# EasyEDA Pro project 进阶学习.eprj

# Schematic Schematic1

## Sheets
1 38译码电路: Board Name: Board1; Create Date: 2024-10-17; Page Name: 38译码电路; Project Name: 进阶学习; Schematic Name: Schematic1; Update Date: 2024-10-17; Company: 嘉立创EDA; Page Size: A4; Version: V1.0
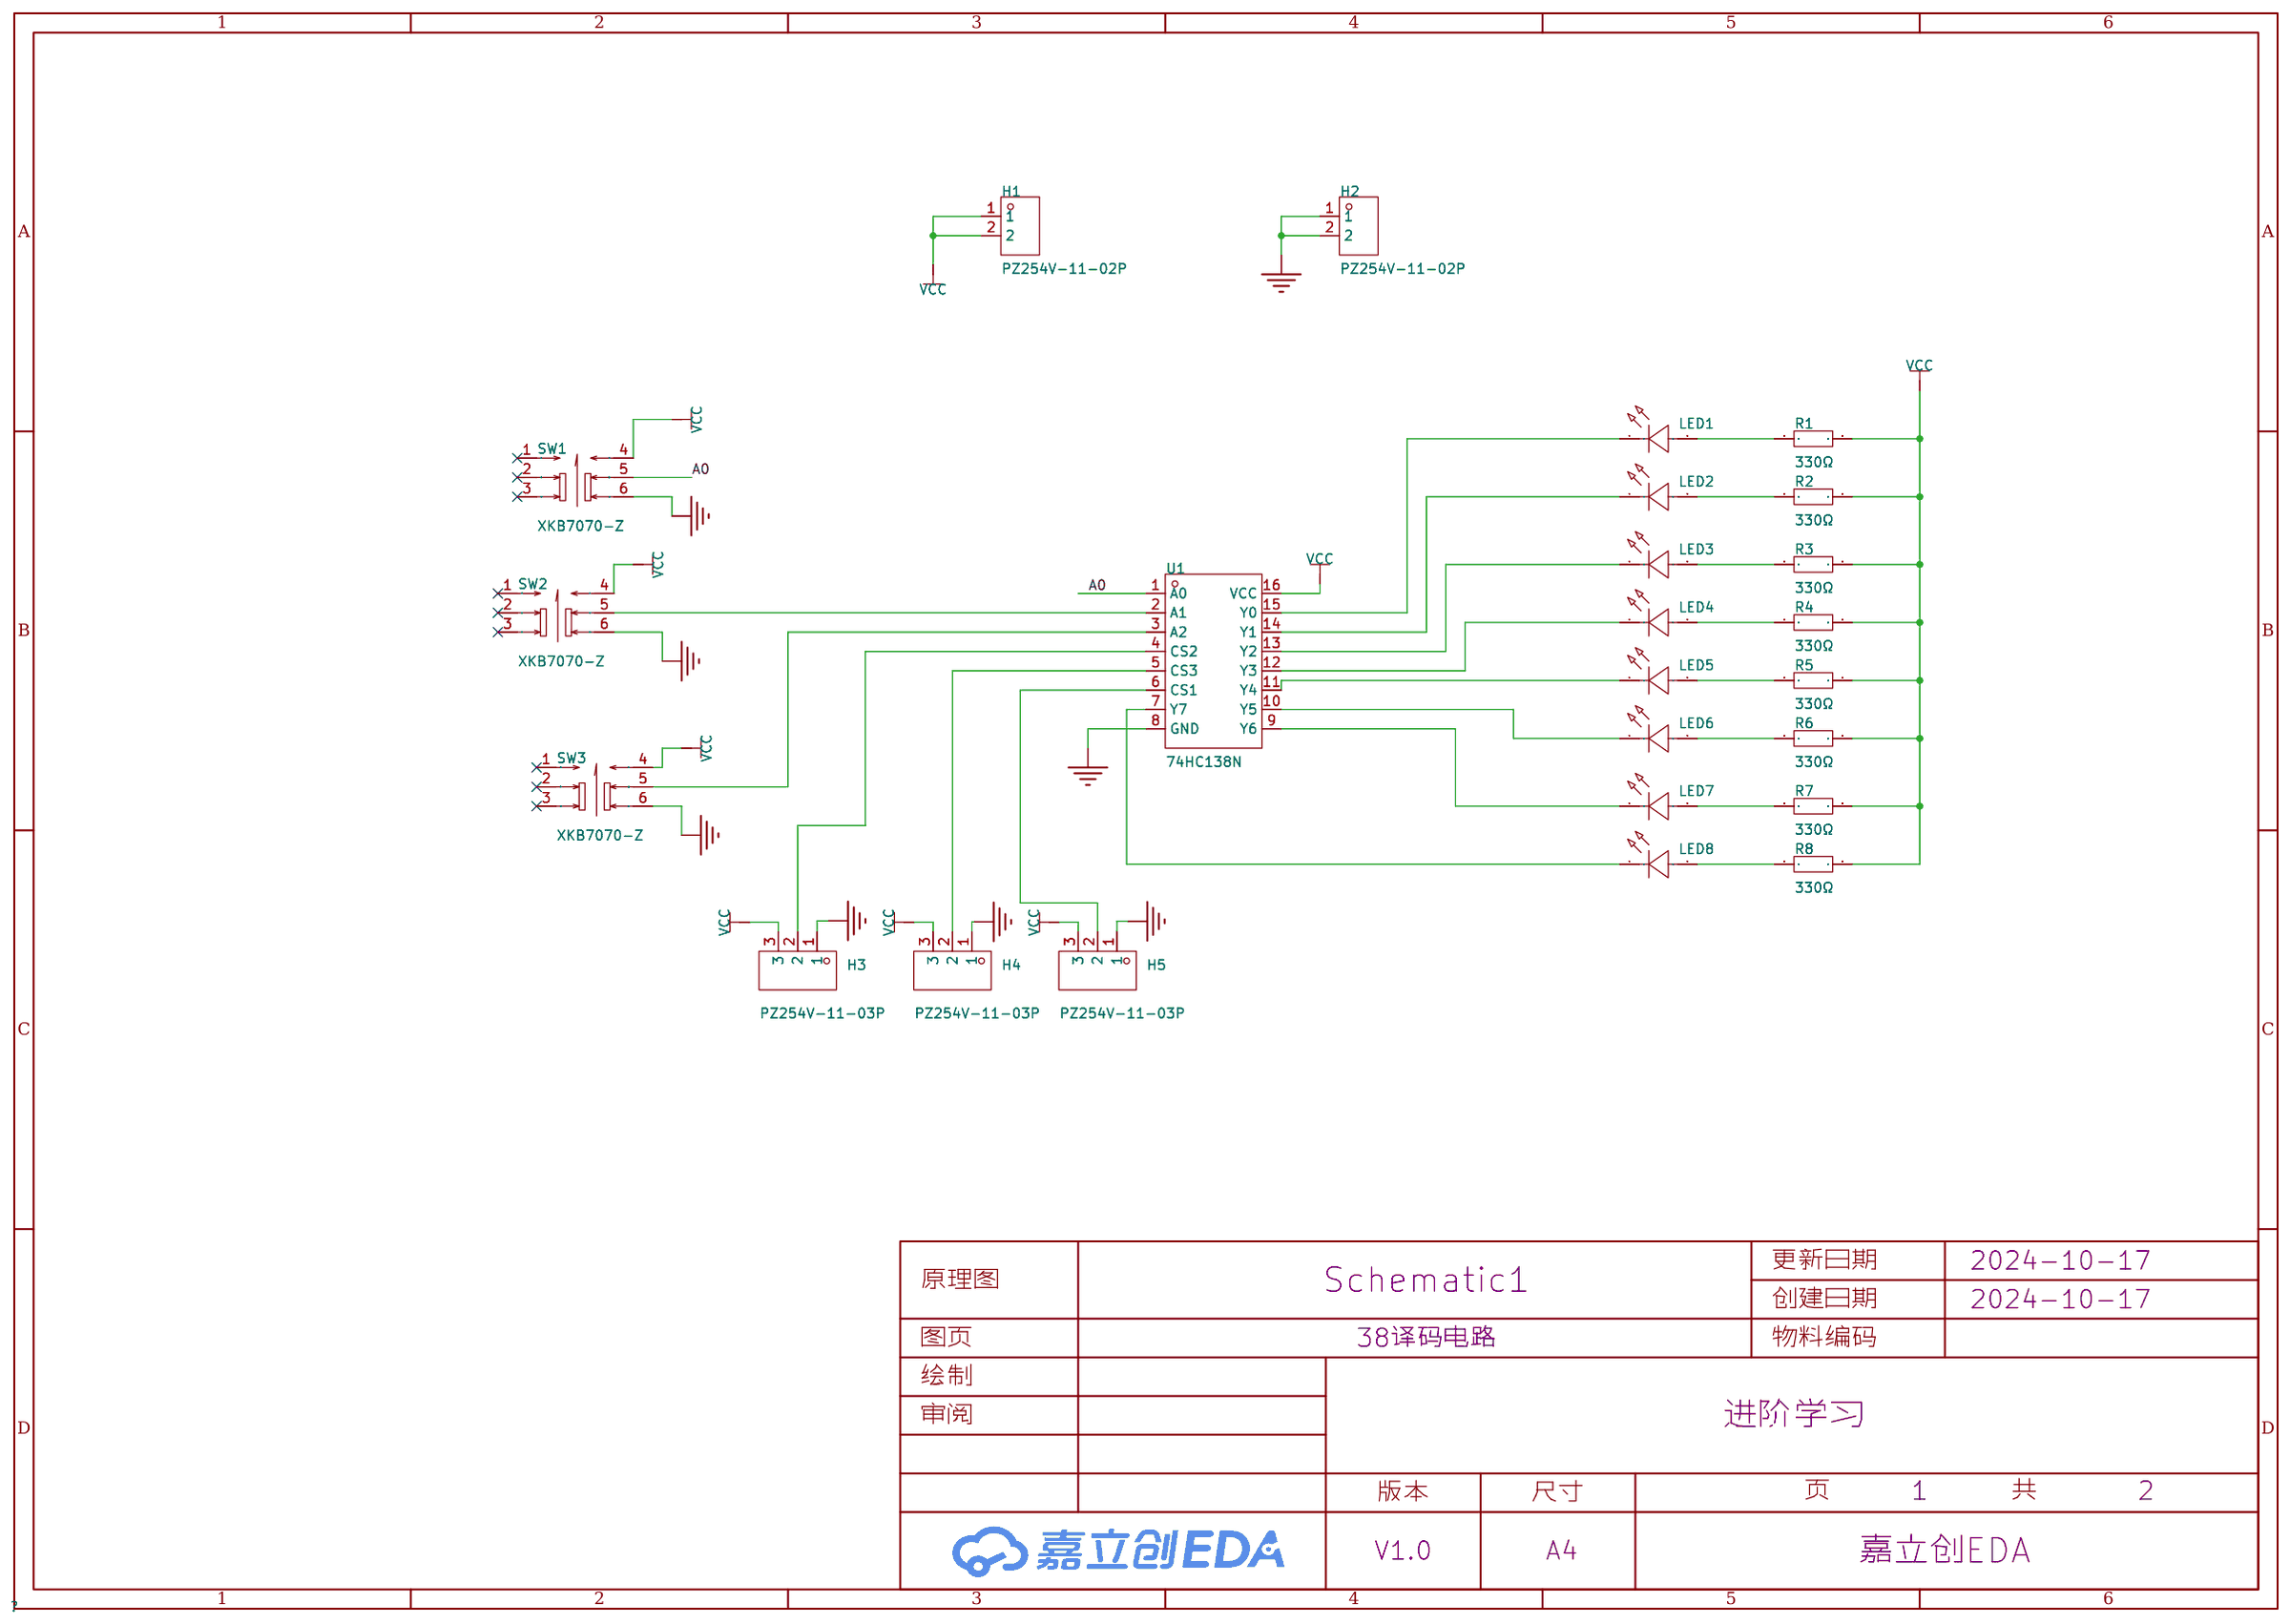
[diagram p0: 38译码电路]
2 245信号放大电路: Page Name: 245信号放大电路
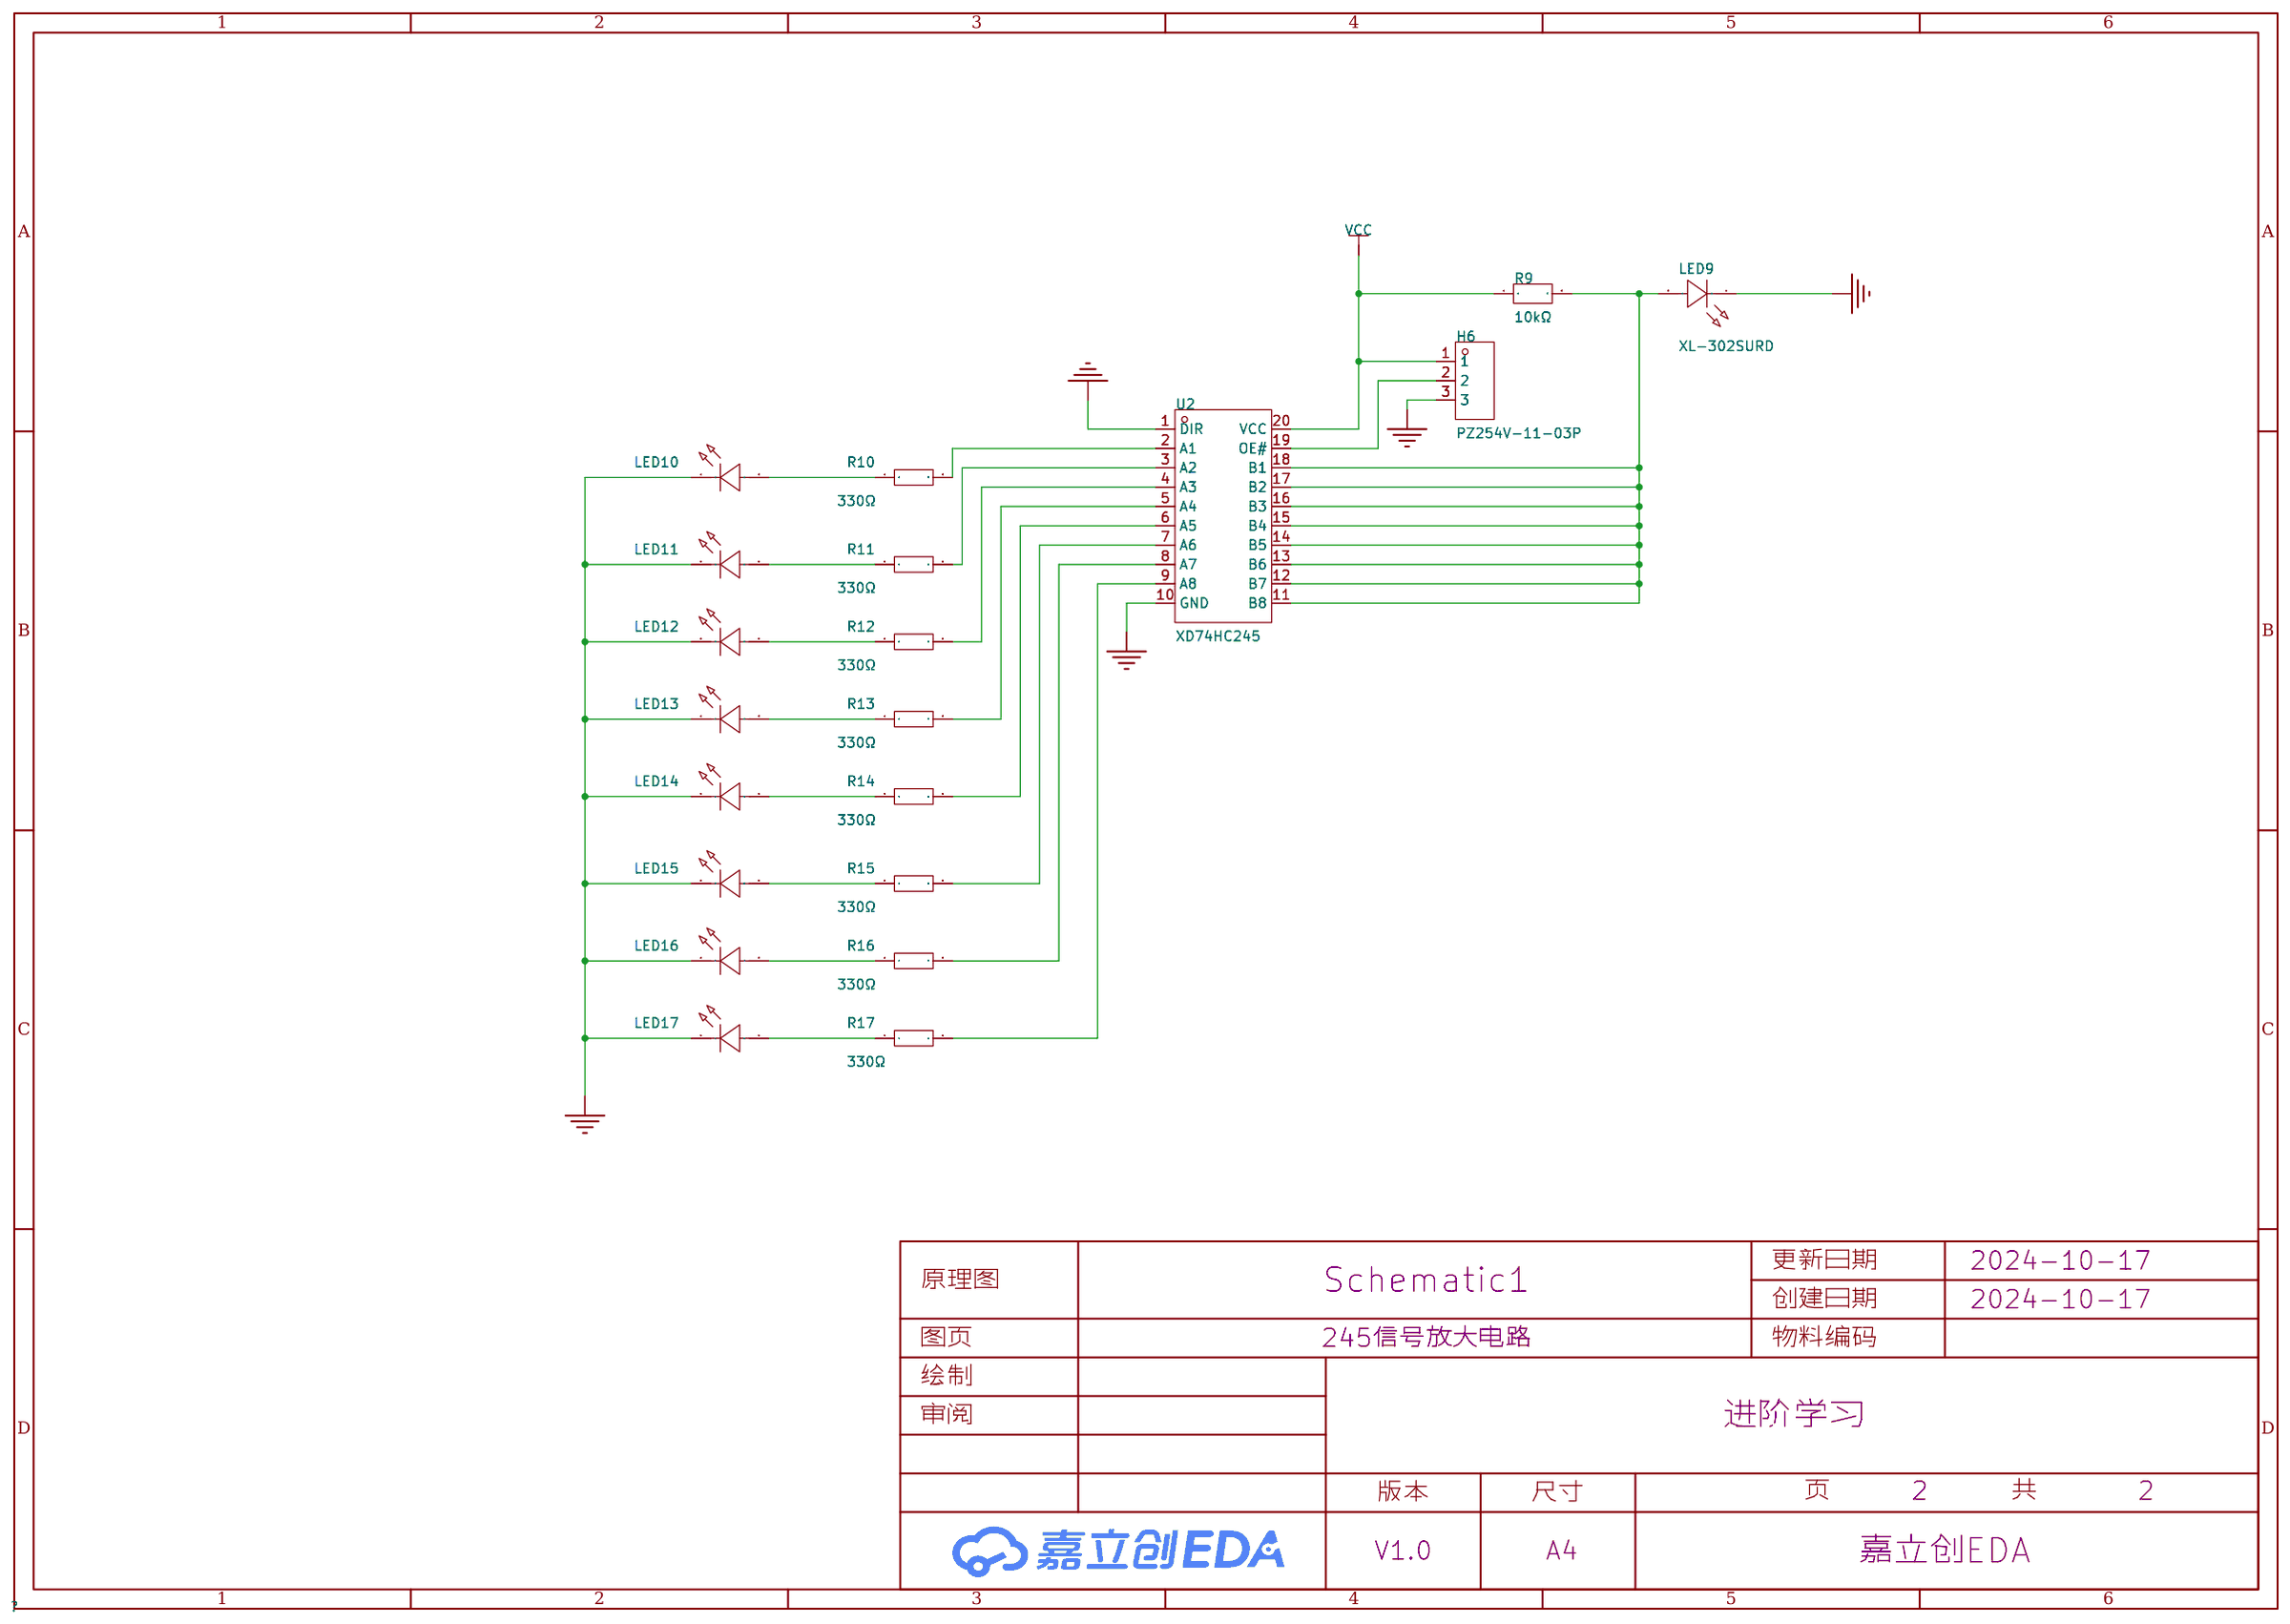
[diagram p1: 245信号放大电路]
3 USB供电: Page Name: USB供电
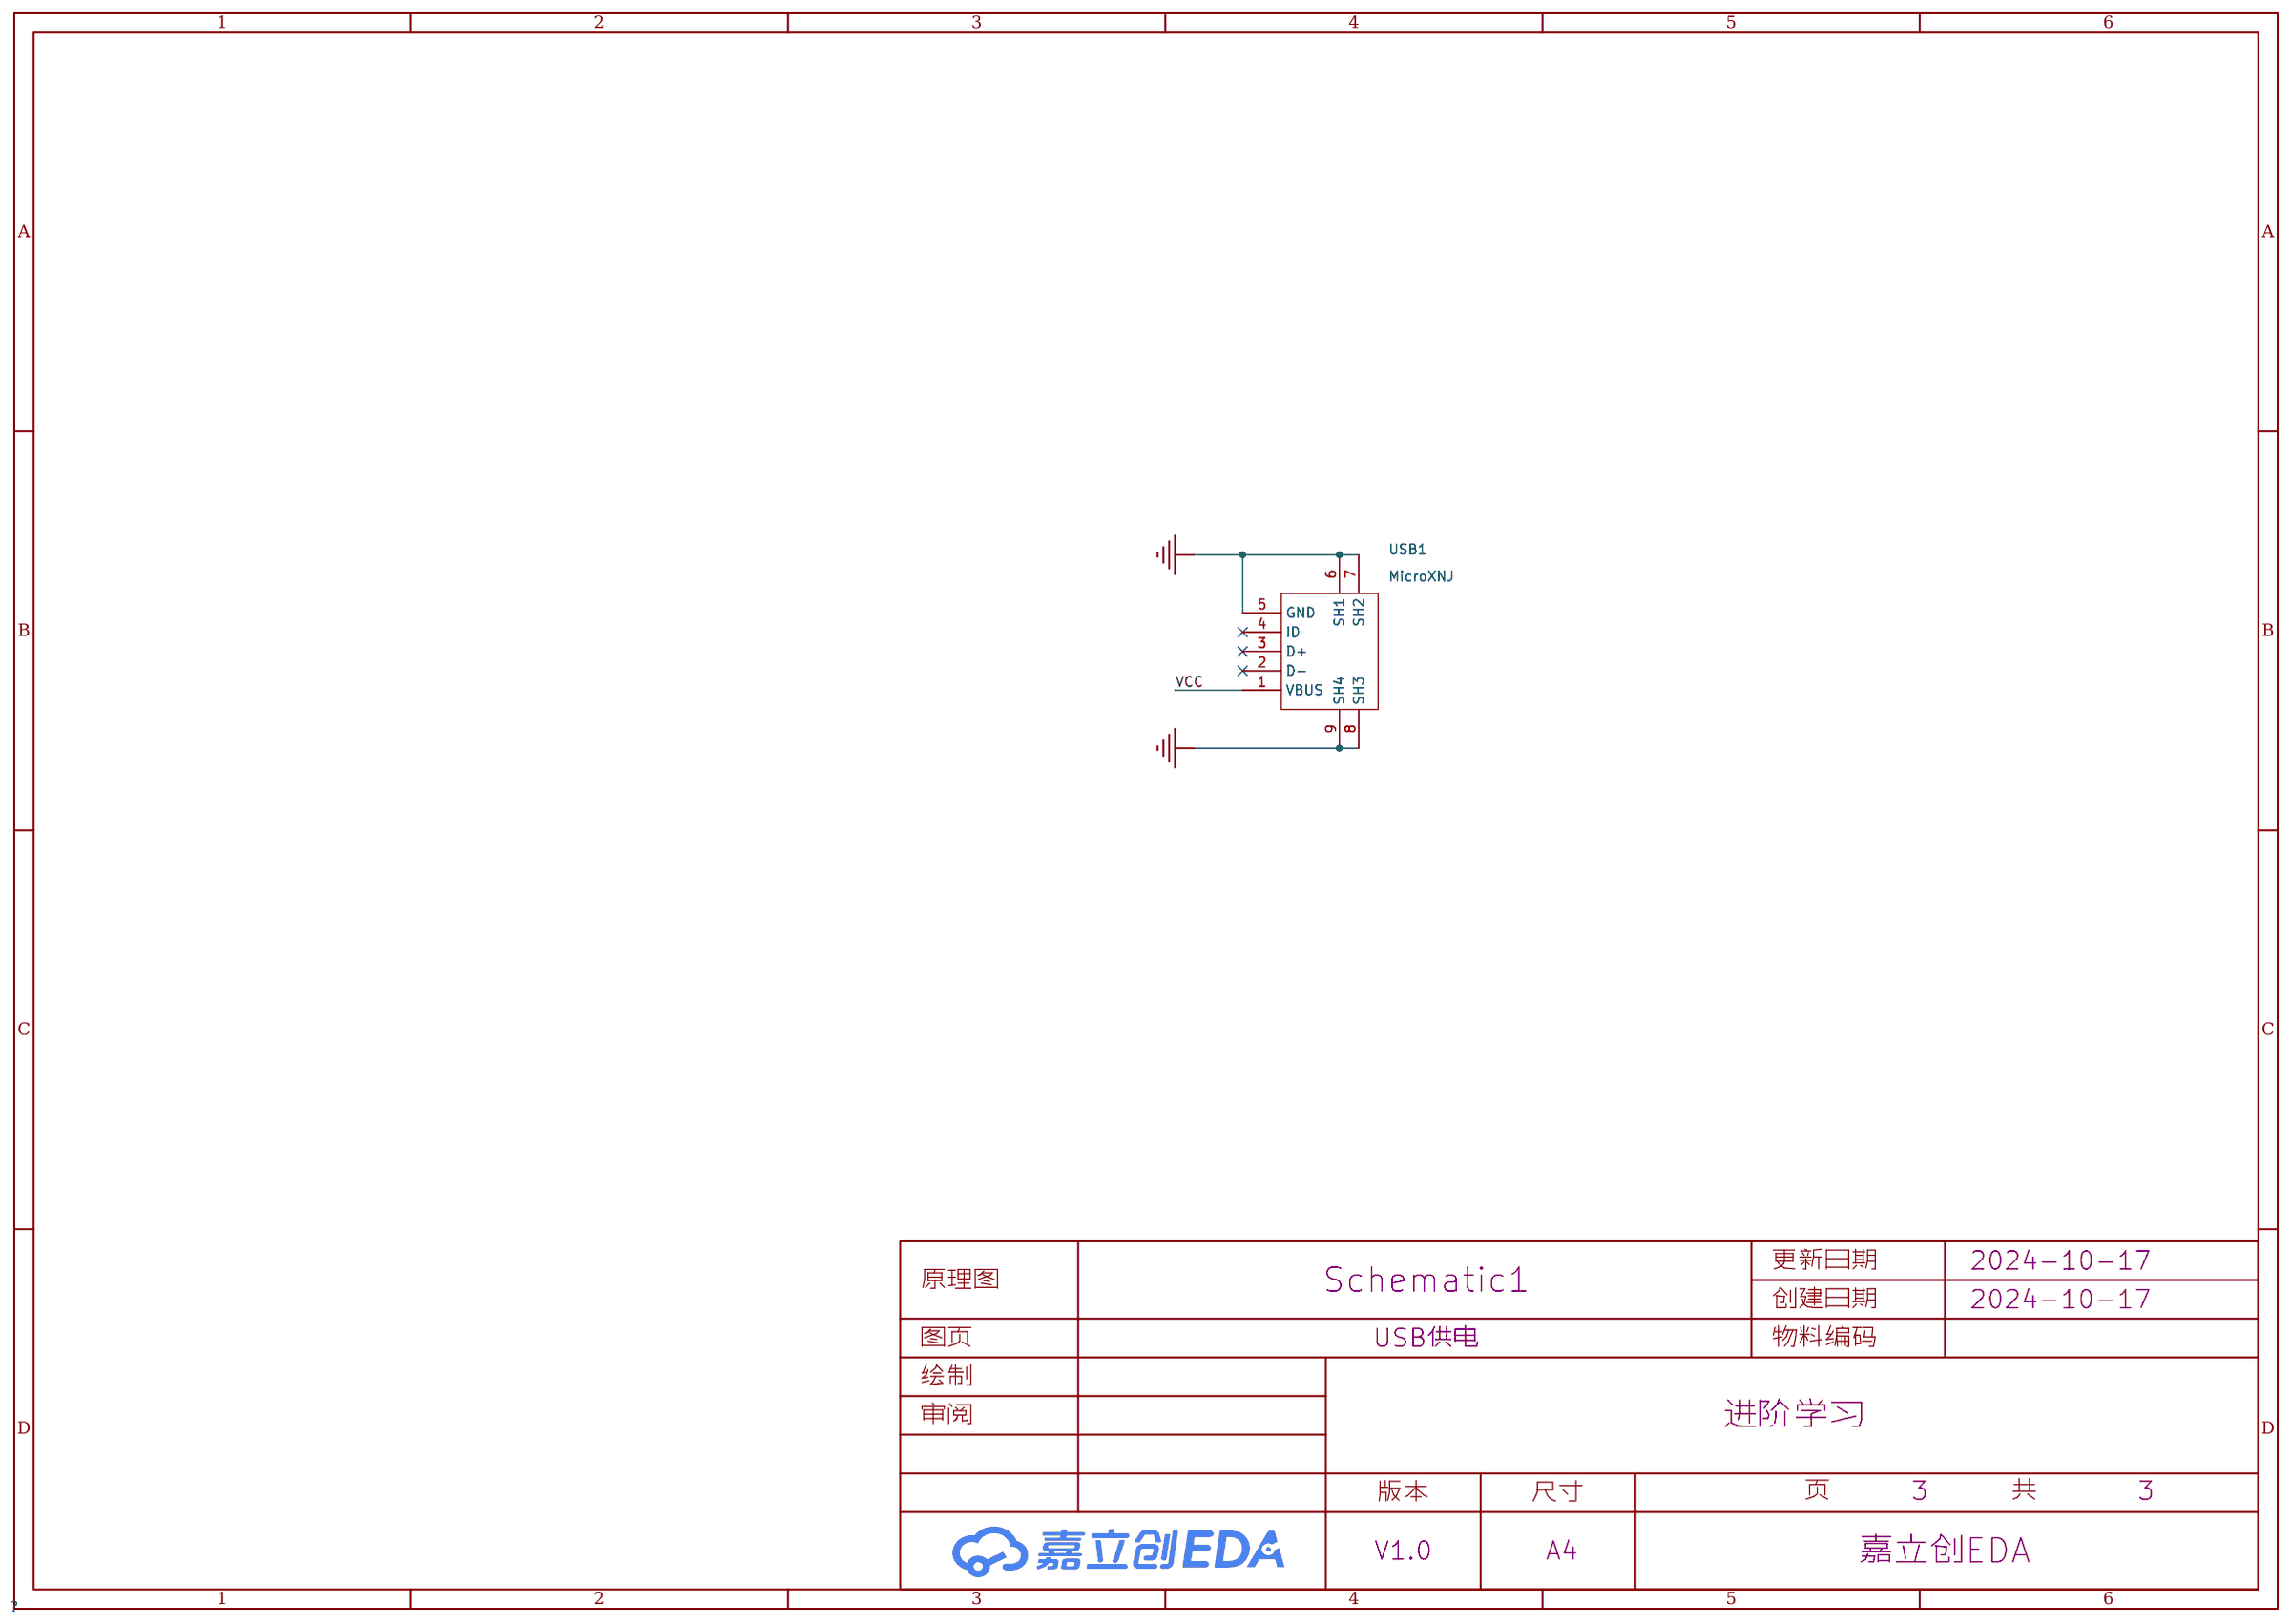
[diagram p2: USB供电]

## Parts
sheet 38译码电路
H1  PZ254V-11-02P  [HDR-TH_2P-P2.54-V-M]
H2  PZ254V-11-02P  [HDR-TH_2P-P2.54-V-M]
H3  PZ254V-11-03P  [HDR-TH_3P-P2.54-V-M]
H4  PZ254V-11-03P  [HDR-TH_3P-P2.54-V-M]
H5  PZ254V-11-03P  [HDR-TH_3P-P2.54-V-M]
LED1  XL-302SURD  [LED-TH_BD3.8-P2.54-RD]
LED2  XL-302SURD  [LED-TH_BD3.8-P2.54-RD]
LED3  XL-302SURD  [LED-TH_BD3.8-P2.54-RD]
LED4  XL-302SURD  [LED-TH_BD3.8-P2.54-RD]
LED5  XL-302SURD  [LED-TH_BD3.8-P2.54-RD]
LED6  XL-302SURD  [LED-TH_BD3.8-P2.54-RD]
LED7  XL-302SURD  [LED-TH_BD3.8-P2.54-RD]
LED8  XL-302SURD  [LED-TH_BD3.8-P2.54-RD]
R1  330Ω  [RES-TH_BD2.3-L3.7-P7.70-D0.9]
R2  330Ω  [RES-TH_BD2.3-L3.7-P7.70-D0.9]
R3  330Ω  [RES-TH_BD2.3-L3.7-P7.70-D0.9]
R4  330Ω  [RES-TH_BD2.3-L3.7-P7.70-D0.9]
R5  330Ω  [RES-TH_BD2.3-L3.7-P7.70-D0.9]
R6  330Ω  [RES-TH_BD2.3-L3.7-P7.70-D0.9]
R7  330Ω  [RES-TH_BD2.3-L3.7-P7.70-D0.9]
R8  330Ω  [RES-TH_BD2.3-L3.7-P7.70-D0.9]
SW1  XKB7070-Z  [SW-TH_6P-L7.0-W7.0-P2.00]
SW2  XKB7070-Z  [SW-TH_6P-L7.0-W7.0-P2.00]
SW3  XKB7070-Z  [SW-TH_6P-L7.0-W7.0-P2.00]
U1  74HC138N  [DIP-16_L19.2-W6.6-P2.54-LS7.6-BL]
sheet 245信号放大电路
H6  PZ254V-11-03P  [HDR-TH_3P-P2.54-V-M]
LED9  XL-302SURD  [LED-TH_BD3.8-P2.54-RD]
LED10  XL-302SURD  [LED-TH_BD3.8-P2.54-RD]
LED11  XL-302SURD  [LED-TH_BD3.8-P2.54-RD]
LED12  XL-302SURD  [LED-TH_BD3.8-P2.54-RD]
LED13  XL-302SURD  [LED-TH_BD3.8-P2.54-RD]
LED14  XL-302SURD  [LED-TH_BD3.8-P2.54-RD]
LED15  XL-302SURD  [LED-TH_BD3.8-P2.54-RD]
LED16  XL-302SURD  [LED-TH_BD3.8-P2.54-RD]
LED17  XL-302SURD  [LED-TH_BD3.8-P2.54-RD]
R9  10kΩ  [RES-TH_BD1.8-L3.2-P7.20-D0.4]
R10  330Ω  [RES-TH_BD2.3-L3.7-P7.70-D0.9]
R11  330Ω  [RES-TH_BD2.3-L3.7-P7.70-D0.9]
R12  330Ω  [RES-TH_BD2.3-L3.7-P7.70-D0.9]
R13  330Ω  [RES-TH_BD2.3-L3.7-P7.70-D0.9]
R14  330Ω  [RES-TH_BD2.3-L3.7-P7.70-D0.9]
R15  330Ω  [RES-TH_BD2.3-L3.7-P7.70-D0.9]
R16  330Ω  [RES-TH_BD2.3-L3.7-P7.70-D0.9]
R17  330Ω  [RES-TH_BD2.3-L3.7-P7.70-D0.9]
U2  XD74HC245  [DIP-20_L26.8-W6.4-P2.54-LS7.6-BL]
sheet USB供电
USB1  MicroXNJ  [MICRO-USB-SMD_MICROXNJ]

## Library data of the parts
H1 H2 = PZ254V-11-02P: LCSC Part Name: 间距:2.54mm 1x2P 直插 方针; Supplier Part: C492401; Manufacturer: XFCN(兴飞); Supplier Footprint: 插件,P=2.54mm; JLCPCB Part Class: Extended Part; Datasheet: https://atta.szlcsc.com/upload/public/pdf/source/20200309/C492401_A812433581A9B211A7FFA413ADDFF0E5.pdf; Supplier: LCSC; Pin Structure: 1x2P; Pitch: 2.54mm; Circluar Pins/Square Pins: 方针; Mounting Type: 直插; Number of Rows: 单排; Number of Pins: 2P; Length of Mating Pin: 6mm; Insulation Height: 2.5mm; Length of End Connection Pin: 3mm; Contact Material: 黄铜; Operating Temperature Range: -40℃~+105℃; Color: 黑色
H3-H6 = PZ254V-11-03P: LCSC Part Name: 间距:2.54mm 1x3P 直插 方针; Supplier Part: C2937625; Manufacturer: XFCN(兴飞); Supplier Footprint: 插件,P=2.54mm; JLCPCB Part Class: Extended Part; Datasheet: https://atta.szlcsc.com/upload/public/pdf/source/20200309/C492402_8335C3D49C4E4C618838D59BB1D024C1.pdf; Supplier: LCSC; Pin Structure: 1x3P; Pitch: 2.54mm; Circluar Pins/Square Pins: 方针; Mounting Type: 直插; Number of Rows: 单排; Number of Pins: 3P; Current Rating (Max): 3A; Voltage Rating (Max): 250V; Length of Mating Pin: 6mm; Insulation Height: 2.5mm; Length of End Connection Pin: 3mm; Operating Temperature Range: -40℃~+105℃; Color: 黑色
LED1-LED17 = XL-302SURD: Supplier Part: C2895470; Manufacturer: XINGLIGHT(成兴光); Supplier Footprint: 插件,D=3mm; JLCPCB Part Class: Extended Part; Datasheet: https://atta.szlcsc.com/upload/public/pdf/source/20240112/E1E2B82945FD635E4907401DDE6D4922.pdf; Supplier: LCSC; Lamp Holder Type: 3mm圆形灯头; Emitted Color: 红色; Power Dissipation: 80mW; Forward Current: 30mA; Dominant Wavelength: 615nm~620nm; Peak Wavelength: 625nm; Lens Color: 红色透镜; Viewing Angle: 50°; Operating Temperature: -25℃~+85℃
R1-R8 R10-R17 = MF1/8W-330Ω±1%-OT52: LCSC Part Name: 金属膜电阻 330Ω ±1% 125mW; Supplier Part: C2848567; Manufacturer: VO(翔胜); Supplier Footprint: 插件,D2.3xL3.7mm; JLCPCB Part Class: Extended Part; Supplier: LCSC; Type: 金属膜电阻; Tolerance: ±1%; Overload Voltage (Max): 200V; Power(Watts): 125mW; Temperature Coefficient: ±350ppm/℃; Operating Temperature Range: -55℃~+155℃
SW1-SW3 = XKB7070-Z: LCSC Part Name: 按键开关   7*7插件自锁 蓝白黑; Supplier Part: C318863; Manufacturer: XKB Connectivity(中国星坤); Supplier Footprint: 插件; JLCPCB Part Class: Extended Part; Datasheet: https://atta.szlcsc.com/upload/public/pdf/source/20211015/75A682A27A424BDE8D93C2CFA14C38FE.pdf; Supplier: LCSC; Self Lock / No Lock: 自锁; Actuator Style: 矩形按钮; Mounting Style: 直插; Contact Current: 100mA; Voltage Rating (AC): 250V; Voltage Rating (DC): 30V; Insulation Resistance: 100MΩ; Actuator/Cap Color: 蓝色; With Lamp: 不带; Pin Style: PC引脚; Operating Force: 160gf; Operating Temperature: -15℃~+55℃; Mechanical Life: 10万次
U1 = 74HC138N: LCSC Part Name: 3 线路至 8 线路解码器/多路解复用器; Supplier Part: C507188; Manufacturer: HGSEMI(华冠); Supplier Footprint: DIP-16; JLCPCB Part Class: Extended Part; Datasheet: https://atta.szlcsc.com/upload/public/pdf/source/20200402/C507188_F3819AAFA86CA4EC01049E7C3DE0780C.pdf; Supplier: LCSC
R9 = MF1/8W-10KΩ±1%T52: LCSC Part Name: 金属膜电阻 10kΩ ±1% 125mW; Supplier Part: C713919; Manufacturer: 华星机电; Supplier Footprint: 插件,D1.8xL3.2mm; JLCPCB Part Class: Extended Part; Datasheet: https://atta.szlcsc.com/upload/public/pdf/source/20200731/C713882_AE8EB1102749D7E4FB4FB13DC898C429.pdf; Supplier: LCSC; Type: 金属膜电阻; Tolerance: ±1%; Power(Watts): 125mW; Temperature Coefficient: ±200ppm/℃
U2 = XD74HC245: LCSC Part Name: 总线收发器; Supplier Part: C561305; Manufacturer: XINLUDA(信路达); Supplier Footprint: DIP-20; JLCPCB Part Class: Extended Part; Datasheet: https://atta.szlcsc.com/upload/public/pdf/source/20240111/A572988226579F08DBAC30D4B3CE857F.pdf; Supplier: LCSC
USB1 = MicroXNJ: LCSC Part Name: Micro-B 母 卧贴; Supplier Part: C404969; Manufacturer: SHOU HAN(首韩); Supplier Footprint: SMD; JLCPCB Part Class: Extended Part; Datasheet: https://atta.szlcsc.com/upload/public/pdf/source/20220415/2494EDFF499AF6F852F7C820374B6AF3.pdf; Supplier: LCSC; Connector Type: Micro-B; Standard: USB 2.0; Gender: 母; Mounting Style: 卧贴; Number of Contacts: 5P; Number of Ports: 1; Current Rating - Power (Max): 1.8A; Operating Temperature Range: -20℃~+85℃; Rated Voltage (Max): 30V; Connect-Disconnect Life: 5千次; Core Colour: 黑色

## Nets
GND: H2.1 H2.2 H3.1 H4.1 H5.1 H6.3 LED9.1(K) LED10.1(K) LED11.1(K) LED12.1(K) LED13.1(K) LED14.1(K) LED15.1(K) LED16.1(K) LED17.1(K) SW1.6 SW2.6 SW3.6 U1.8(GND) U2.1(DIR) U2.10(GND) USB1.5(GND) USB1.6(SH1) USB1.7(SH2) USB1.8(SH3) USB1.9(SH4)
VCC: H1.1 H1.2 H3.3 H4.3 H5.3 H6.1 R1.2 R2.2 R3.2 R4.2 R5.2 R6.2 R7.2 R8.2 R9.1 SW1.4 SW2.4 SW3.4 U1.16(VCC) U2.20(VCC) USB1.1(VBUS)
A0: SW1.5 U1.1(A0)
$1N861: SW2.5 U1.2(A1)
$1N867: SW3.5 U1.3(A2)
$1N1243: H3.2 U1.4(CS2)
$1N1250: H4.2 U1.5(CS3)
$1N1260: H5.2 U1.6(CS1)
$1N1626: LED1.2(A) R1.1
$1N1753: LED2.2(A) R2.1
$1N1833: LED3.2(A) R3.1
$1N1913: LED4.2(A) R4.1
$1N1993: LED5.2(A) R5.1
$1N2073: LED6.2(A) R6.1
$1N2153: LED7.2(A) R7.1
$1N2233: LED8.2(A) R8.1
$1N2237: LED1.1(K) U1.15(Y0)
$1N2246: LED2.1(K) U1.14(Y1)
$1N2256: LED3.1(K) U1.13(Y2)
$1N2272: LED4.1(K) U1.12(Y3)
$1N2298: LED5.1(K) U1.11(Y4)
$1N2309: LED6.1(K) U1.10(Y5)
$1N2315: LED7.1(K) U1.9(Y6)
$1N2322: LED8.1(K) U1.7(Y7)
$2N390: H6.2 U2.19(OE#)
$2N604: LED9.2(A) R9.2 U2.11(B8) U2.12(B7) U2.13(B6) U2.14(B5) U2.15(B4) U2.16(B3) U2.17(B2) U2.18(B1)
$2N1200: LED10.2(A) R10.1
$2N1362: LED11.2(A) R11.1
$2N1442: LED12.2(A) R12.1
$2N1522: LED13.2(A) R13.1
$2N1836: LED14.2(A) R14.1
$2N1838: LED15.2(A) R15.1
$2N1840: LED16.2(A) R16.1
$2N1842: LED17.2(A) R17.1
$2N1854: R10.2 U2.2(A1)
$2N1859: R11.2 U2.3(A2)
$2N1866: R12.2 U2.4(A3)
$2N1873: R13.2 U2.5(A4)
$2N1880: R14.2 U2.6(A5)
$2N1889: R15.2 U2.7(A6)
$2N1896: R16.2 U2.8(A7)
$2N1903: R17.2 U2.9(A8)

Not connected (* = marked no-connect by the designer): SW1 1* 2* 3*; SW2 1* 2* 3*; SW3 1* 2* 3*; USB1 2(D-)* 3(D+)* 4(ID)*

# Board PCB1
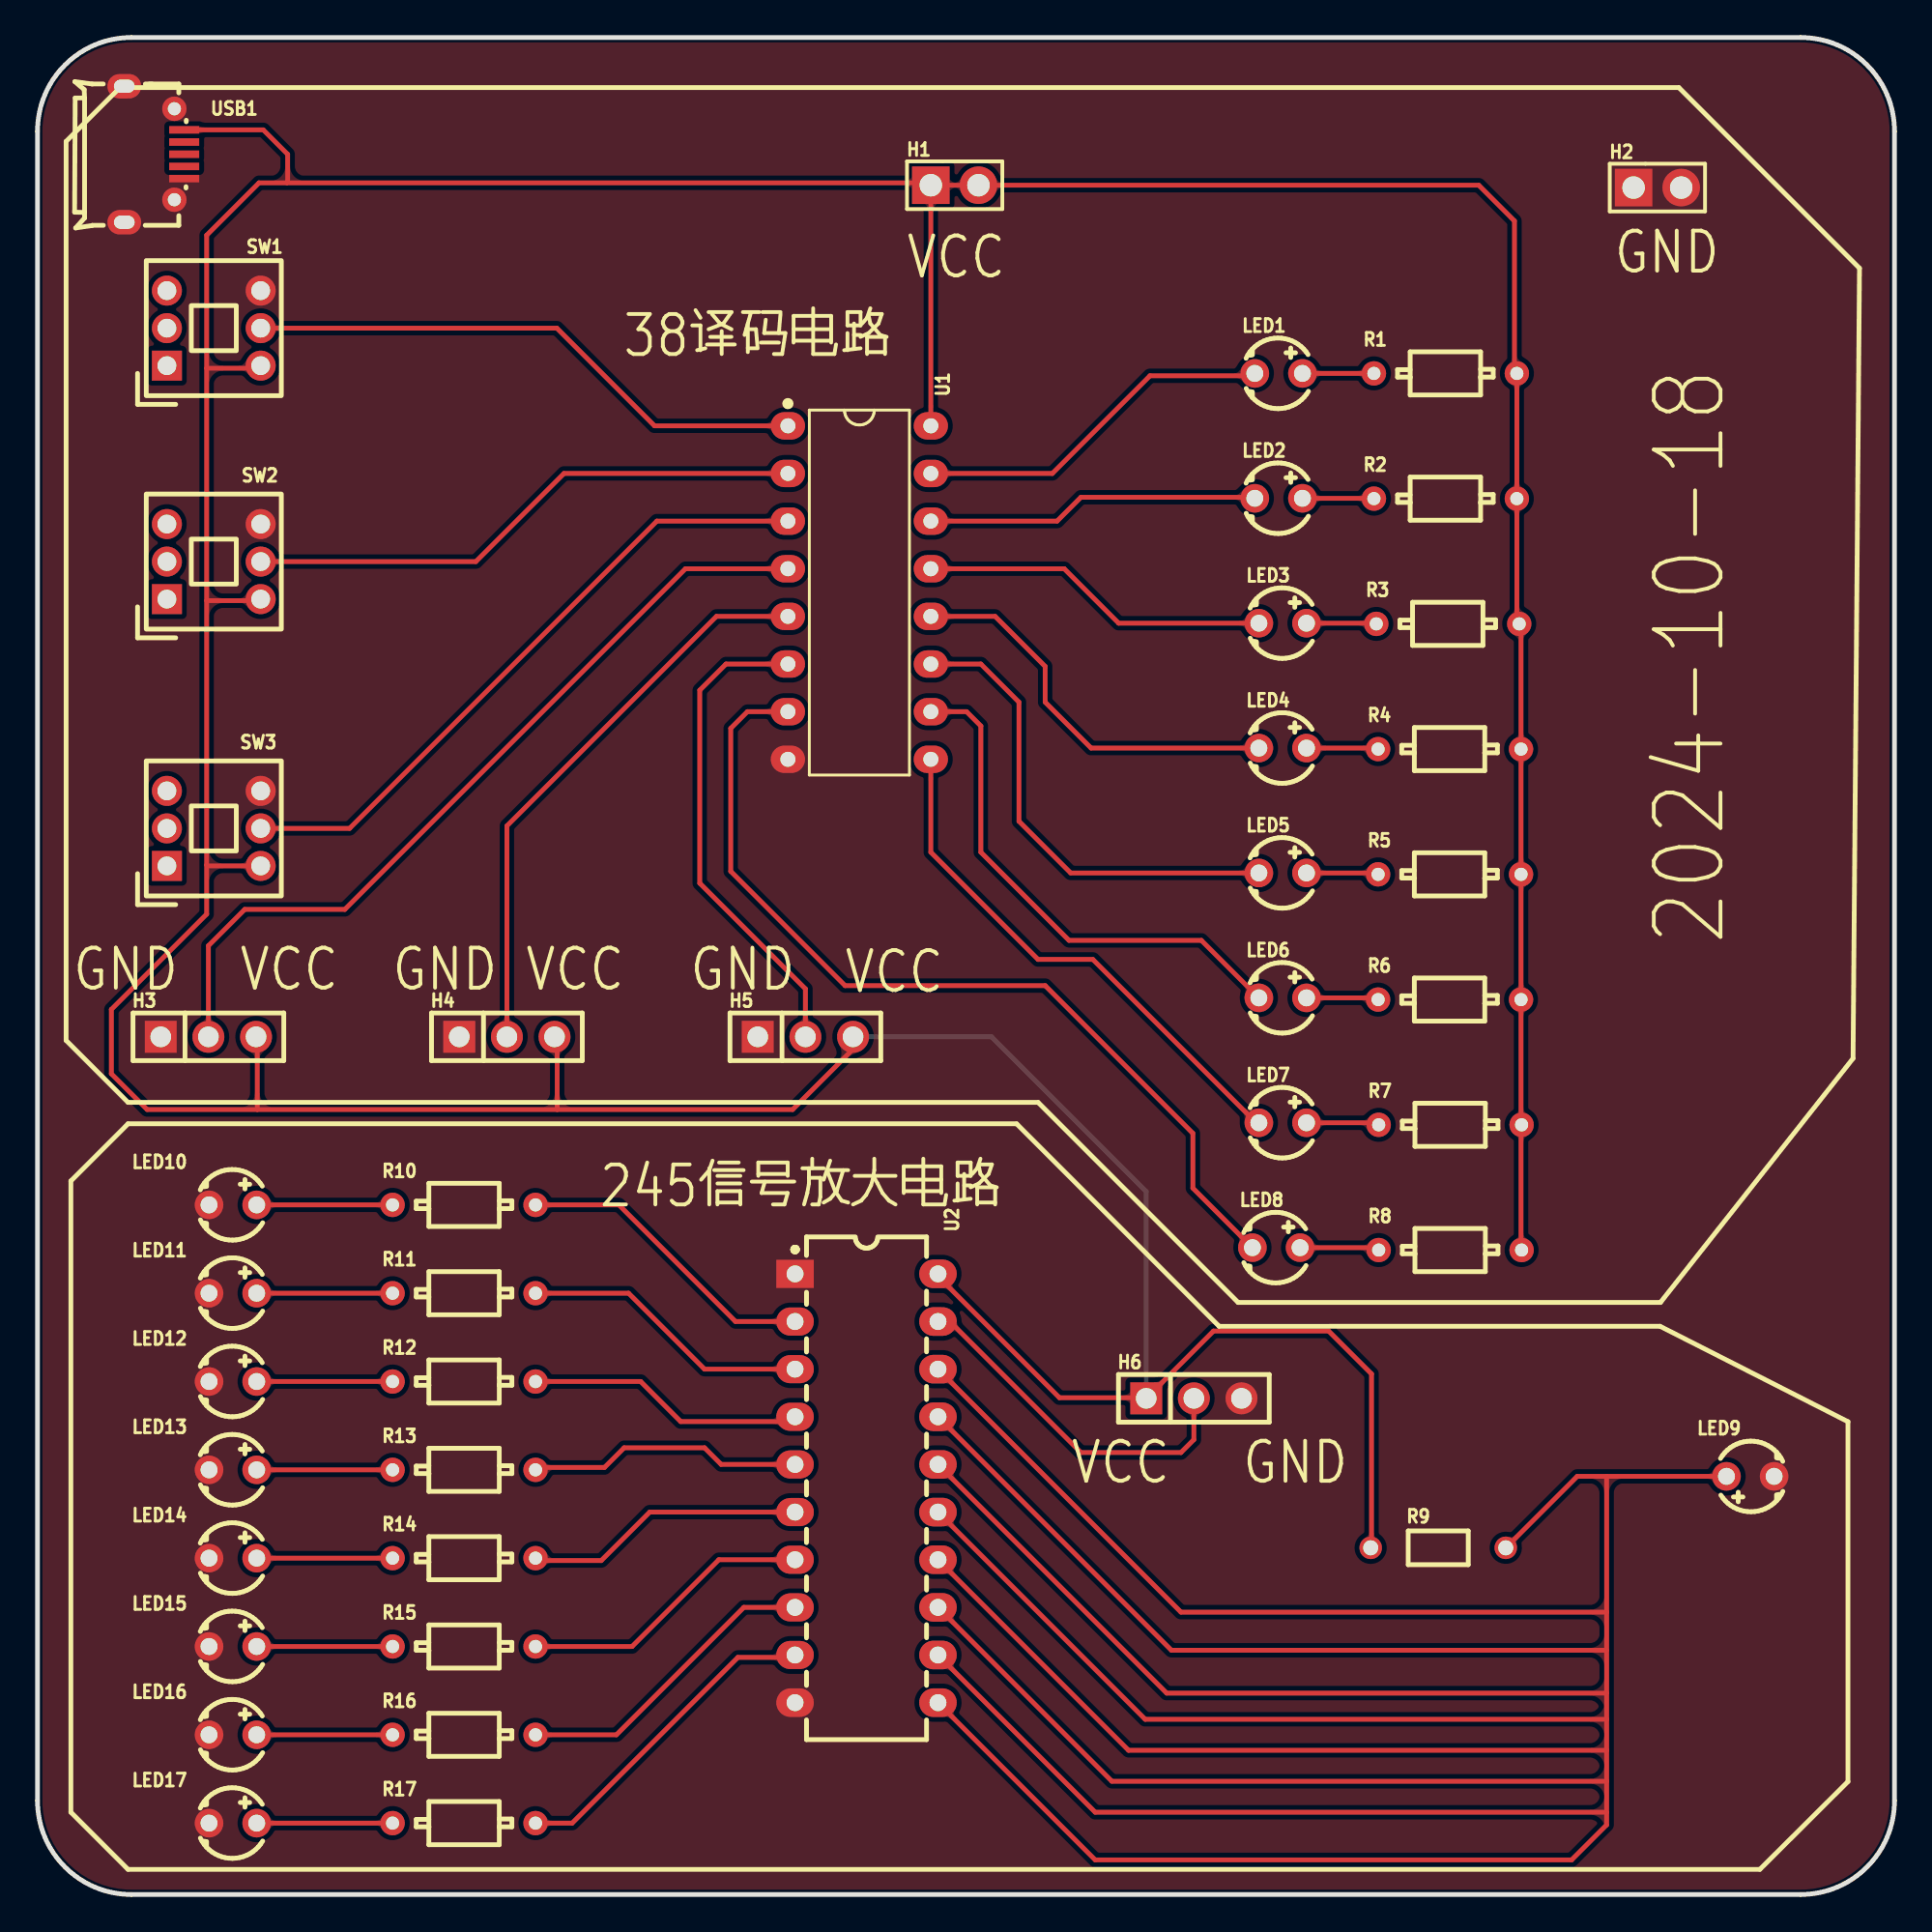
[diagram p3: board, top side]
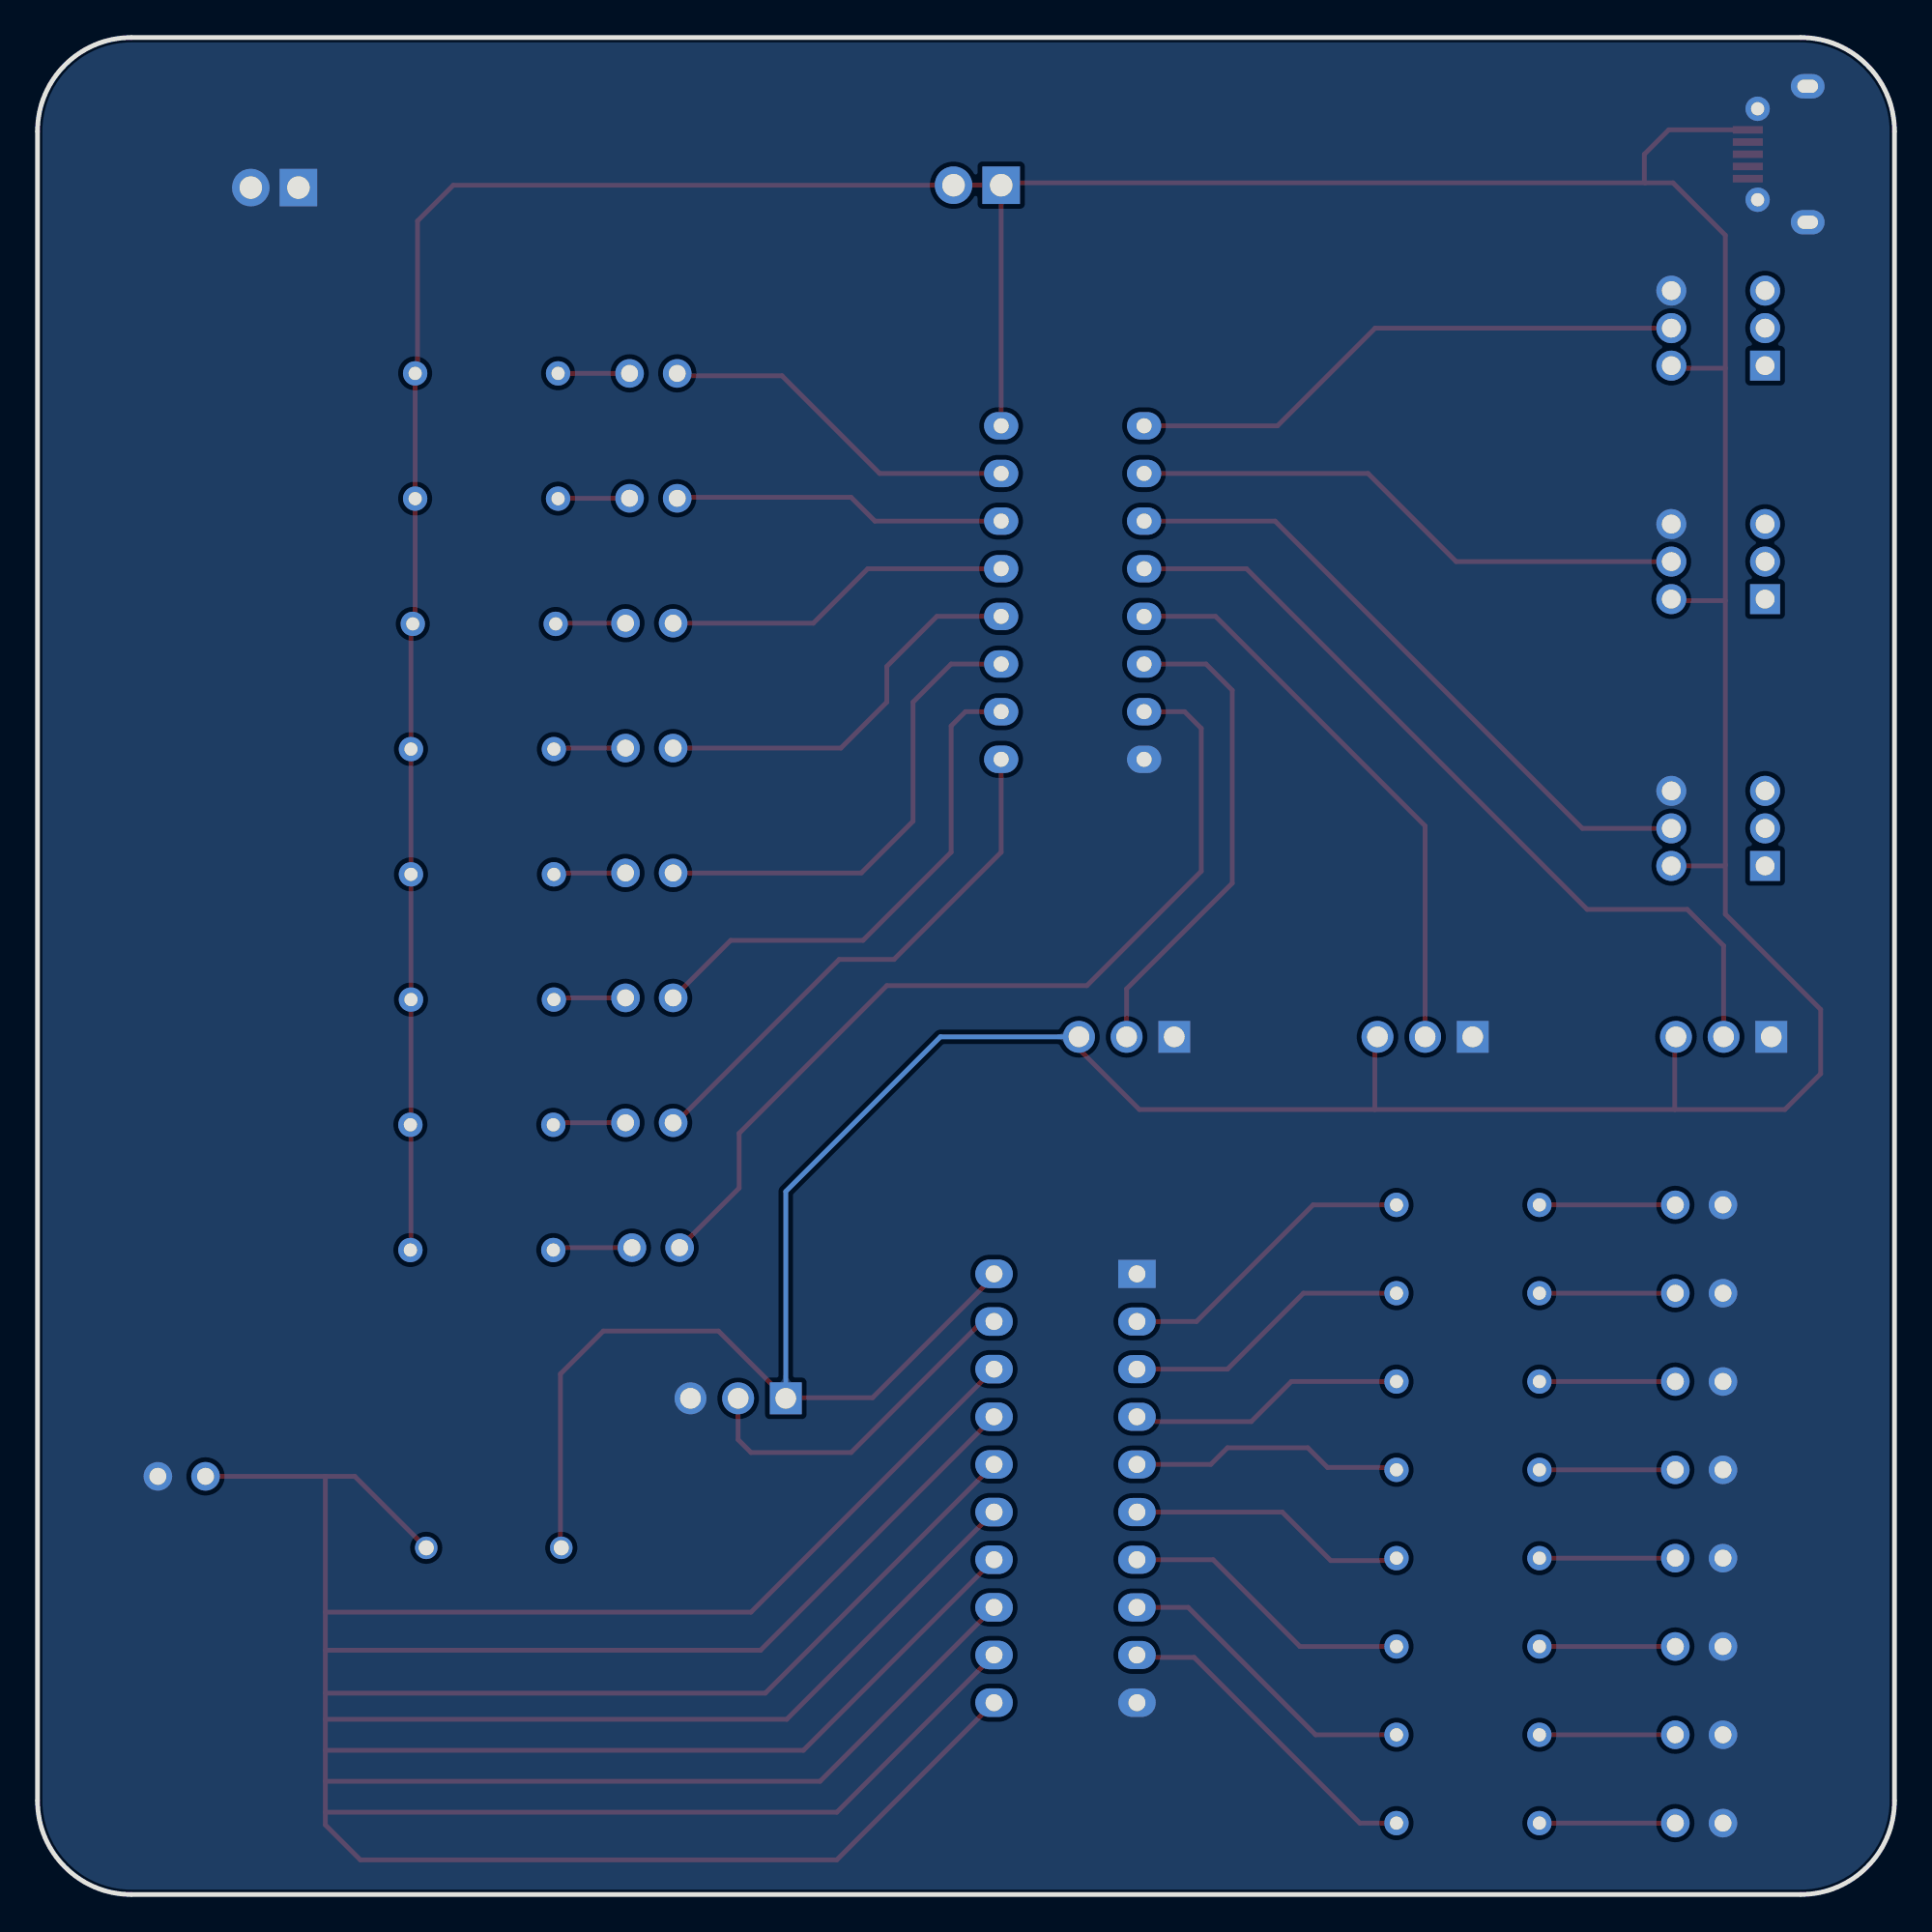
[diagram p4: board, bottom side, seen from below]

Outline 99 x 99 mm; copper layers: Top Layer, Bottom Layer. Coordinates in mm from the lower left corner of the outline.
Outline path: 0,94 0,5 arc(1.46,1.46) 5,0 94,0 arc(97.54,1.46) 99,5 99,94 arc(97.54,97.54) 94,99 5,99 arc(1.46,97.54) 0,94
Stack: Top Layer 0.035mm / Dielectric1 1.51mm FR4 er 4.5 / Bottom Layer 0.035mm

## Design rules (mm)
template: Custom Config
spacing copperThickness1oz (default): track to track 0.102, other pairs 0.152 to 0.3
spacing copperThickness2oz: track to track 0.203, other pairs 0.152 to 0.3
track width copperThickness1oz (default): min 0.127, default 0.254, max 2.54
track width copperThickness2oz: min 0.203, default 0.254, max 2.54
differential pair differentialPair (default): width min 0.127, default 0.254, max 2.54; gap min 0.152, default 0.152
via viaSize (default): diameter min 0.5, default 0.61, max 10; hole min 0.3, default 0.305, max 6.3

## Placement (name value [footprint] x y rotation side)
H1  PZ254V-11-02P  [HDR-TH_2P-P2.54-V-M]  48.9 91.13 0 top
H2  PZ254V-11-02P  [HDR-TH_2P-P2.54-V-M]  86.36 91 0 top
H3  PZ254V-11-03P  [HDR-TH_3P-P2.54-V-M]  9.11 45.72 0 top
H4  PZ254V-11-03P  [HDR-TH_3P-P2.54-V-M]  25.02 45.72 0 top
H5  PZ254V-11-03P  [HDR-TH_3P-P2.54-V-M]  40.94 45.72 0 top
H6  PZ254V-11-03P  [HDR-TH_3P-P2.54-V-M]  61.65 26.45 0 top
LED1  XL-302SURD  [LED-TH_BD3.8-P2.54-RD]  66.17 81.09 0 top
LED2  XL-302SURD  [LED-TH_BD3.8-P2.54-RD]  66.17 74.43 0 top
LED3  XL-302SURD  [LED-TH_BD3.8-P2.54-RD]  66.38 67.78 0 top
LED4  XL-302SURD  [LED-TH_BD3.8-P2.54-RD]  66.38 61.12 0 top
LED5  XL-302SURD  [LED-TH_BD3.8-P2.54-RD]  66.38 54.46 0 top
LED6  XL-302SURD  [LED-TH_BD3.8-P2.54-RD]  66.38 47.8 0 top
LED7  XL-302SURD  [LED-TH_BD3.8-P2.54-RD]  66.38 41.14 0 top
LED8  XL-302SURD  [LED-TH_BD3.8-P2.54-RD]  66.04 34.48 0 top
LED9  XL-302SURD  [LED-TH_BD3.8-P2.54-RD]  91.31 22.29 180 top
LED10  XL-302SURD  [LED-TH_BD3.8-P2.54-RD]  10.41 36.76 0 top
LED11  XL-302SURD  [LED-TH_BD3.8-P2.54-RD]  10.41 32.06 0 top
LED12  XL-302SURD  [LED-TH_BD3.8-P2.54-RD]  10.41 27.35 0 top
LED13  XL-302SURD  [LED-TH_BD3.8-P2.54-RD]  10.41 22.64 0 top
LED14  XL-302SURD  [LED-TH_BD3.8-P2.54-RD]  10.41 17.93 0 top
LED15  XL-302SURD  [LED-TH_BD3.8-P2.54-RD]  10.41 13.22 0 top
LED16  XL-302SURD  [LED-TH_BD3.8-P2.54-RD]  10.41 8.51 0 top
LED17  XL-302SURD  [LED-TH_BD3.8-P2.54-RD]  10.41 3.8 0 top
R1  330Ω  [RES-TH_BD2.3-L3.7-P7.70-D0.9]  75.06 81.09 0 top
R2  330Ω  [RES-TH_BD2.3-L3.7-P7.70-D0.9]  75.06 74.42 0 top
R3  330Ω  [RES-TH_BD2.3-L3.7-P7.70-D0.9]  75.18 67.74 0 top
R4  330Ω  [RES-TH_BD2.3-L3.7-P7.70-D0.9]  75.28 61.06 0 top
R5  330Ω  [RES-TH_BD2.3-L3.7-P7.70-D0.9]  75.28 54.39 0 top
R6  330Ω  [RES-TH_BD2.3-L3.7-P7.70-D0.9]  75.28 47.71 0 top
R7  330Ω  [RES-TH_BD2.3-L3.7-P7.70-D0.9]  75.31 41.03 0 top
R8  330Ω  [RES-TH_BD2.3-L3.7-P7.70-D0.9]  75.31 34.36 0 top
R9  10kΩ  [RES-TH_BD1.8-L3.2-P7.20-D0.4]  74.68 18.48 0 top
R10  330Ω  [RES-TH_BD2.3-L3.7-P7.70-D0.9]  22.74 36.76 0 top
R11  330Ω  [RES-TH_BD2.3-L3.7-P7.70-D0.9]  22.74 32.06 0 top
R12  330Ω  [RES-TH_BD2.3-L3.7-P7.70-D0.9]  22.74 27.35 0 top
R13  330Ω  [RES-TH_BD2.3-L3.7-P7.70-D0.9]  22.74 22.64 0 top
R14  330Ω  [RES-TH_BD2.3-L3.7-P7.70-D0.9]  22.74 17.93 0 top
R15  330Ω  [RES-TH_BD2.3-L3.7-P7.70-D0.9]  22.74 13.22 0 top
R16  330Ω  [RES-TH_BD2.3-L3.7-P7.70-D0.9]  22.74 8.51 0 top
R17  330Ω  [RES-TH_BD2.3-L3.7-P7.70-D0.9]  22.74 3.8 0 top
SW1  XKB7070-Z  [SW-TH_6P-L7.0-W7.0-P2.00]  9.4 83.51 180 top
SW2  XKB7070-Z  [SW-TH_6P-L7.0-W7.0-P2.00]  9.4 71.06 180 top
SW3  XKB7070-Z  [SW-TH_6P-L7.0-W7.0-P2.00]  9.4 56.84 180 top
U1  74HC138N  [DIP-16_L19.2-W6.6-P2.54-LS7.6-BL]  43.81 69.41 270 top
U2  XD74HC245  [DIP-20_L26.8-W6.4-P2.54-LS7.6-BL]  44.2 21.66 270 top
USB1  MicroXNJ  [MICRO-USB-SMD_MICROXNJ]  6.22 92.78 270 top

## Footprints (pads in the part's own frame, mm; a bottom-side part is the same pattern mirrored in y, then rotated)
DIP-16_L19.2-W6.6-P2.54-LS7.6-BL
  oval 1.46x1.825 hole 0.8: 1(-8.89,-3.81) 2(-6.35,-3.81) 3(-3.81,-3.81) 4(-1.27,-3.81) 5(1.27,-3.81) 6(3.81,-3.81) 7(6.35,-3.81) 8(8.89,-3.81) 9(8.89,3.81) 10(6.35,3.81) 11(3.81,3.81) 12(1.27,3.81) 13(-1.27,3.81) 14(-3.81,3.81) 15(-6.35,3.81) 16(-8.89,3.81)
DIP-20_L26.8-W6.4-P2.54-LS7.6-BL
  rect 1.5x2 hole 0.9: 1(-11.43,-3.81)
  oval 1.5x2 hole 0.9: 2(-8.89,-3.81) 3(-6.35,-3.81) 4(-3.81,-3.81) 5(-1.27,-3.81) 6(1.27,-3.81) 7(3.81,-3.81) 8(6.35,-3.81) 9(8.89,-3.81)
  oval 1.524x2 hole 0.9: 10(11.43,-3.81) 11(11.43,3.81) 12(8.89,3.81) 13(6.35,3.81) 14(3.81,3.81) 15(1.27,3.81) 16(-1.27,3.81) 17(-3.81,3.81) 18(-6.35,3.81) 19(-8.89,3.81) 20(-11.43,3.81)
HDR-TH_2P-P2.54-V-M
  rect 2x2 hole 1.2: 1(-1.27,0)
  round 2 hole 1.2: 2(1.27,0)
HDR-TH_3P-P2.54-V-M
  rect 1.7x1.7 hole 1.1: 1(-2.54,0)
  round 1.7 hole 1.1: 2(0,0) 3(2.54,0)
LED-TH_BD3.8-P2.54-RD
  round 1.524 hole 0.9: 1(-1.27,0) 2(1.27,0)
MICRO-USB-SMD_MICROXNJ
  rect 0.4x1.6 smd: 1(-1.3,1.597) 2(-0.65,1.597) 3(0,1.597) 4(0.65,1.597) 5(1.3,1.597)
  round 1.3 hole 0.7: 6(2.425,1.074) 9(-2.425,1.073)
  oval 1.3x1.8 hole 0.7x1.1: 7(3.625,-1.597) 8(-3.625,-1.597)
RES-TH_BD1.8-L3.2-P7.20-D0.4
  round 1.2 hole 0.8: 1(-3.6,0) 2(3.6,0)
RES-TH_BD2.3-L3.7-P7.70-D0.9
  round 1.3 hole 0.7: 1(-3.81,0) 2(3.81,0)
SW-TH_6P-L7.0-W7.0-P2.00
  rect 1.6x1.6 hole 1: 1(2.499,2)
  round 1.6 hole 1: 2(2.5,0) 3(2.5,-2) 4(-2.5,2) 5(-2.5,0) 6(-2.5,-2)

## Nets
As in the schematic.

Pads without a net: SW1 1 2 3; SW2 1 2 3; SW3 1 2 3; USB1 2 3 4

## Routing (per net, layer and track width the routed paths; a pad name or vN(x,y) marks a point on that pad's centre or on a via; arc(x,y) is an arc through that point)
VCC: length 320.6
  Top Layer w0.254: 9.02,68.98 11.82,68.98 SW2.4 ; 9.02,68.98 9.02,54.88 ; 9.02,68.98 9.02,81.37 ; 13.3,91.25 11.81,91.25 9.02,88.46 9.02,81.37 ; 13.3,91.25 13.33,91.29 13.33,92.78 12.03,94.08 USB1.1 ; 13.3,91.25 47.5,91.25 H1.1 ; H1.1 76.84,91.13 78.74,89.22 78.74,81.22 R1.2 R2.2 78.87,67.87 R3.2 79.09,67.64 R4.2 R5.2 R6.2 79.09,34.39 R8.2 ; H1.1 U1.16 ; 9.02,54.88 9.06,54.84 SW3.4 ; 9.02,54.88 9.02,52.26 3.94,47.18 3.94,43.75 5.84,41.85 11.72,41.85 ; 27.7,41.85 27.7,45.58 H4.3 ; 27.7,41.85 40.26,41.85 43.48,45.07 H5.3 ; 27.7,41.85 11.72,41.85 ; SW1.4 11.76,81.37 9.02,81.37 ; U2.20 48.01,32.96 54.48,26.48 59.08,26.48 H6.1 62.7,30.04 68.83,30.04 71.12,27.75 71.12,18.53 R9.1 ; 11.72,41.85 11.72,45.66 H3.3
  Bottom Layer w0.254: H6.1 59.11,37.48 50.86,45.72 H5.3
A0: length 30.3
  Top Layer w0.254: U1.1 32.89,78.3 27.69,83.51 SW1.5
$1N861: length 30.1
  Top Layer w0.254: U1.2 28.07,75.76 23.37,71.06 SW2.5
$1N867: length 34.9
  Top Layer w0.254: SW3.5 16.64,56.84 33.02,73.22 U1.3
$1N1243: length 44.1
  Top Layer w0.254: H3.2 9.11,50.58 11.05,52.52 16.38,52.52 34.54,70.68 U1.4
$1N1250: length 30.9
  Top Layer w0.254: H4.2 25.02,56.97 36.19,68.14 U1.5
$1N1260: length 26.1
  Top Layer w0.254: U1.6 36.7,65.6 35.31,64.2 35.31,53.92 40.94,48.28 H5.2
$1N1626: length 3.8
  Top Layer w0.254: LED1.2 R1.1
$1N1753: length 3.8
  Top Layer w0.254: LED2.2 71.23,74.43 R2.1
$1N1833: length 3.7
  Top Layer w0.254: R3.1 71.34,67.78 67.65,67.78
$1N1913: length 3.8
  Top Layer w0.254: 67.65,61.12 71.42,61.12 R4.1
$1N1993: length 3.8
  Top Layer w0.254: 67.65,54.46 71.4,54.46 R5.1
$1N2073: length 3.9
  Top Layer w0.254: 67.65,47.8 71.38,47.8 R6.1
$1N2153: length 3.9
  Top Layer w0.254: R7.1 71.39,41.14 67.65,41.14
$1N2233: length 4.2
  Top Layer w0.254: R8.1 71.37,34.48 LED8.2
$1N2237: length 19.5
  Top Layer w0.254: LED1.1 64.77,80.97 59.31,80.97 54.1,75.76 U1.15
$1N2246: length 17.8
  Top Layer w0.254: LED2.1 64.84,74.49 55.63,74.49 54.36,73.22 U1.14
$1N2256: length 18.7
  Top Layer w0.254: U1.13 54.74,70.68 57.64,67.78 LED3.1
$1N2272: length 21.5
  Top Layer w0.254: U1.12 51.05,68.14 53.72,65.47 53.72,63.57 56.17,61.12 LED4.1
$1N2298: length 25.8
  Top Layer w0.254: LED5.1 55.08,54.46 52.32,57.22 52.32,63.57 50.29,65.6 U1.11
$1N2309: length 27.8
  Top Layer w0.254: U1.10 49.53,63.06 50.29,62.3 50.29,55.57 54.99,50.87 62.05,50.87 LED6.1
$1N2315: length 28.4
  Top Layer w0.254: LED7.1 64.97,41.14 56.26,49.85 53.34,49.85 47.62,55.57 U1.9
$1N2322: length 48.9
  Top Layer w0.254: U1.7 37.85,63.06 36.96,62.17 36.96,54.55 43.05,48.45 53.72,48.45 61.59,40.58 61.59,37.66 LED8.1
$2N390: length 19
  Top Layer w0.254: H6.2 61.65,24.25 60.96,23.56 55.63,23.56 48.64,30.55 U2.19
$2N604: length 353
  Top Layer w0.254: 83.65,4.38 56.39,4.38 U2.12 ; 83.65,4.38 83.65,3.71 81.79,1.84 56.39,1.84 U2.11 ; 83.65,4.38 83.65,6.04 ; 83.65,15.05 83.65,13.02 ; 83.65,15.05 60.96,15.05 U2.18 ; 83.65,15.05 83.65,22.29 ; 83.65,13.02 83.65,10.74 ; 83.65,13.02 60.45,13.02 U2.17 ; 83.65,10.74 83.65,9.34 ; 83.65,10.74 60.2,10.74 U2.16 ; 83.65,9.34 59.06,9.34 U2.15 ; 83.65,9.34 83.65,7.69 ; U2.13 57.28,6.04 83.65,6.04 ; U2.14 58.17,7.69 83.65,7.69 ; 83.65,7.69 83.65,6.04 ; 90.04,22.29 83.65,22.29 ; 83.65,22.29 82.09,22.29 R9.2
$2N1200: length 7.2
  Top Layer w0.254: R10.1 LED10.2
$2N1362: length 7.2
  Top Layer w0.254: LED11.2 R11.1
$2N1442: length 7.2
  Top Layer w0.254: LED12.2 R12.1
$2N1522: length 7.2
  Top Layer w0.254: LED13.2 R13.1
$2N1836: length 7.2
  Top Layer w0.254: R14.1 LED14.2
$2N1838: length 7.2
  Top Layer w0.254: LED15.2 R15.1
$2N1840: length 7.2
  Top Layer w0.254: LED16.2 R16.1
$2N1842: length 7.2
  Top Layer w0.254: LED17.2 R17.1
$2N1854: length 16.4
  Top Layer w0.254: R10.2 30.99,36.76 37.21,30.55 U2.2
$2N1859: length 15.5
  Top Layer w0.254: R11.2 31.51,32.06 35.56,28.01 U2.3
$2N1866: length 14.8
  Top Layer w0.254: R12.2 32.16,27.35 34.29,25.21 40.13,25.21 U2.4
$2N1873: length 14.7
  Top Layer w0.254: U2.5 36.45,22.93 35.56,23.82 31.28,23.82 30.23,22.77 26.68,22.77 R13.2
$2N1880: length 15
  Top Layer w0.254: R14.2 26.68,17.8 30.06,17.8 32.64,20.39 U2.6
$2N1889: length 15.8
  Top Layer w0.254: U2.7 36.32,17.85 31.7,13.22 R15.2
$2N1896: length 16.7
  Top Layer w0.254: R16.2 30.86,8.51 37.66,15.31 U2.8
$2N1903: length 17.5
  Top Layer w0.254: R17.2 28.5,3.8 37.34,12.64 40.26,12.64 U2.9

## Copper pours and planes (outline as drawn; the poured copper is in the pictures)
GND on Top Layer: -2.16,101.54 103.12,101.54 103.12,-3.24 -2.16,-3.24
GND on Bottom Layer: -5.21,103.95 106.3,103.95 106.3,-2.47 -5.21,-2.47

Small or netless copper shapes (teardrops, artwork), in the pictures only: 134 on Top Layer, 2 on Bottom Layer

## Text on the board
Top Silkscreen Layer: GND | VCC | 2024-10-18 | 245信号放大电路 | 38译码电路
